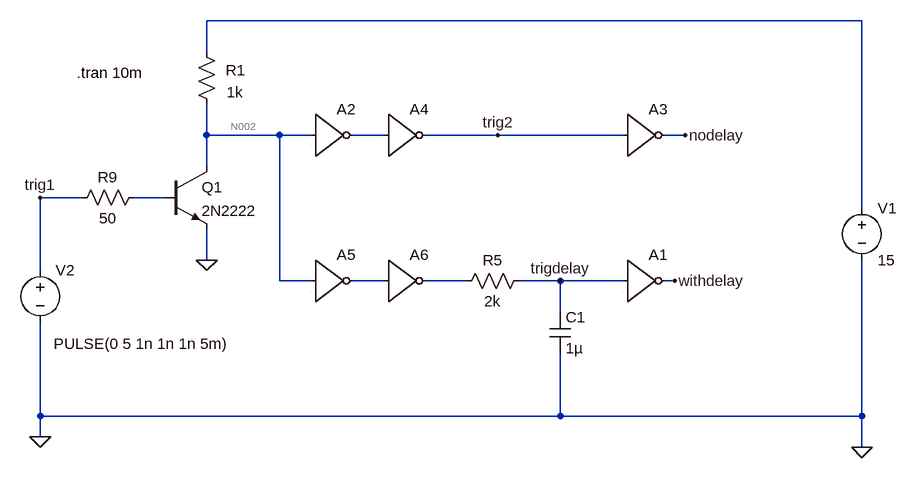
[diagram p0: schematic dc-contactor-delay-circuit.asc]
dc-contactor-delay-circuit.asc, the LTspice schematic file:
Version 4
SHEET 1 880 680
WIRE 432 -96 -576 -96
WIRE -576 -48 -576 -96
WIRE -576 80 -576 32
WIRE -464 80 -576 80
WIRE -416 80 -464 80
WIRE -304 80 -352 80
WIRE -128 80 -240 80
WIRE 64 80 -128 80
WIRE 160 80 128 80
WIRE -576 128 -576 80
WIRE -768 176 -832 176
WIRE -640 176 -688 176
WIRE 432 192 432 -96
WIRE -576 272 -576 224
WIRE -832 288 -832 176
WIRE -464 304 -464 80
WIRE -416 304 -464 304
WIRE -304 304 -352 304
WIRE -176 304 -240 304
WIRE -32 304 -96 304
WIRE 64 304 -32 304
WIRE 144 304 128 304
WIRE -32 352 -32 304
WIRE -832 512 -832 368
WIRE -32 512 -32 416
WIRE -32 512 -832 512
WIRE 432 512 432 272
WIRE 432 512 -32 512
WIRE -832 544 -832 512
WIRE 432 560 432 512
FLAG -832 544 0
FLAG -576 272 0
FLAG 432 560 0
FLAG 160 80 nodelay
FLAG 144 304 withdelay
FLAG -128 80 trig2
FLAG -832 176 trig1
FLAG -32 304 trigdelay
SYMBOL voltage 432 176 R0
WINDOW 123 0 0 Left 0
WINDOW 39 0 0 Left 0
SYMATTR InstName V1
SYMATTR Value 15
SYMBOL npn -640 128 R0
SYMATTR InstName Q1
SYMATTR Value 2N2222
SYMBOL res -80 288 R90
WINDOW 0 0 56 VBottom 2
WINDOW 3 32 56 VTop 2
SYMATTR InstName R5
SYMATTR Value 2k
SYMBOL cap -48 352 R0
SYMATTR InstName C1
SYMATTR Value 1µ
SYMBOL voltage -832 272 R0
WINDOW 3 291 129 Right 2
WINDOW 123 0 0 Left 0
WINDOW 39 0 0 Left 0
SYMATTR Value PULSE(0 5 1n 1n 1n 5m)
SYMATTR InstName V2
SYMBOL res -784 192 R270
WINDOW 0 32 56 VTop 2
WINDOW 3 0 56 VBottom 2
SYMATTR InstName R9
SYMATTR Value 50
SYMBOL res -592 -64 R0
WINDOW 0 45 44 Left 2
WINDOW 3 47 78 Left 2
SYMATTR InstName R1
SYMATTR Value 1k
SYMBOL Digital\\inv 64 16 R0
WINDOW 3 8 60 Invisible 2
SYMATTR Value Vhigh = 15,Vt = 7.4, Vh = 1.8
SYMATTR InstName A3
SYMBOL Digital\\inv 64 240 R0
WINDOW 3 8 60 Invisible 2
SYMATTR Value Vhigh = 15,Vt = 7.4, Vh = 1.8
SYMATTR InstName A1
SYMBOL Digital\\inv -416 16 R0
WINDOW 3 8 60 Invisible 2
SYMATTR Value Vhigh = 15,Vt = 7.4, Vh = 1.8
SYMATTR InstName A2
SYMBOL Digital\\inv -304 16 R0
WINDOW 3 8 60 Invisible 2
SYMATTR Value Vhigh = 15,Vt = 7.4, Vh = 1.8
SYMATTR InstName A4
SYMBOL Digital\\inv -416 240 R0
WINDOW 3 8 60 Invisible 2
SYMATTR Value Vhigh = 15,Vt = 7.4, Vh = 1.8
SYMATTR InstName A5
SYMBOL Digital\\inv -304 240 R0
WINDOW 3 8 60 Invisible 2
SYMATTR Value Vhigh = 15,Vt = 7.4, Vh = 1.8
SYMATTR InstName A6
TEXT -776 -16 Left 2 !.tran 10m

The netlist it stands for:
* dc-contactor-delay-circuit.asc
V1 N001 0 15
Q1 N002 N004 0 0 2N2222
R5 trigdelay N006 2k
C1 trigdelay 0 1µ
V2 trig1 0 PULSE(0 5 1n 1n 1n 5m)
R9 trig1 N004 50
R1 N001 N002 1k
A3 trig2 0 0 0 0 nodelay 0 0 BUF Vhigh = 15,Vt = 7.4, Vh = 1.8
A1 trigdelay 0 0 0 0 withdelay 0 0 BUF Vhigh = 15,Vt = 7.4, Vh = 1.8
A2 N002 0 0 0 0 N003 0 0 BUF Vhigh = 15,Vt = 7.4, Vh = 1.8
A4 N003 0 0 0 0 trig2 0 0 BUF Vhigh = 15,Vt = 7.4, Vh = 1.8
A5 N002 0 0 0 0 N005 0 0 BUF Vhigh = 15,Vt = 7.4, Vh = 1.8
A6 N005 0 0 0 0 N006 0 0 BUF Vhigh = 15,Vt = 7.4, Vh = 1.8
.model NPN NPN
.model PNP PNP
.lib standard.bjt
.tran 10m
.backanno
.end

* Results of the author's LTspice run, read from the files saved beside the schematic
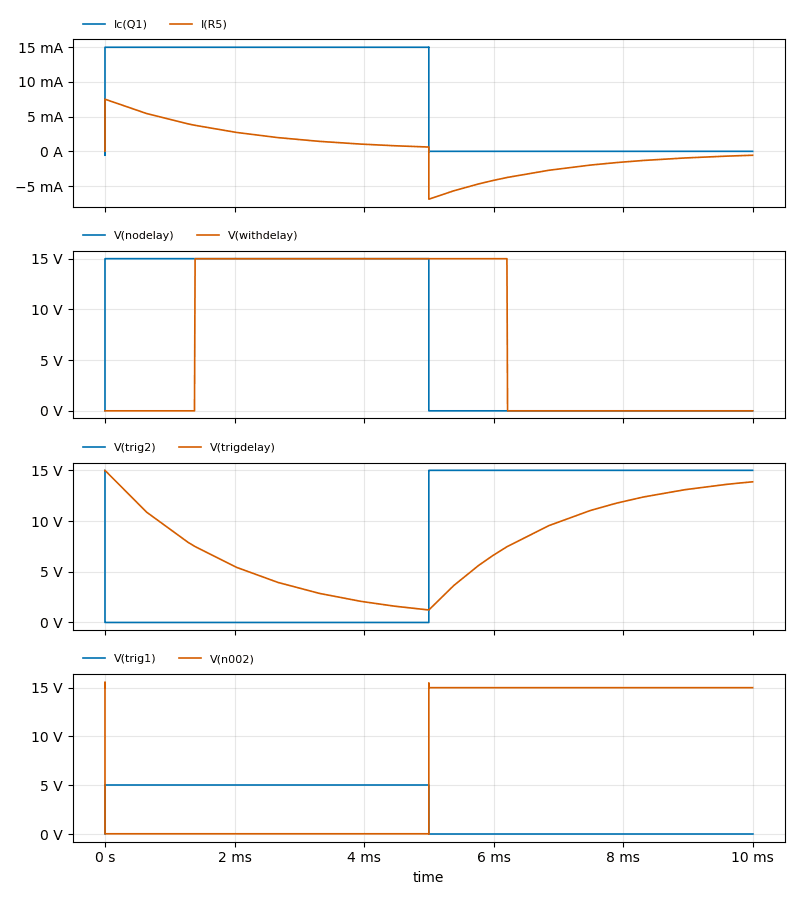
[diagram p1: Transient Analysis of dc-contactor-delay-circuit.asc, plotted from the saved traces]
* Transient Analysis, 1 run:
*   Ic(Q1): min -578.9 µA, max 14.99 mA, average 7.483 mA, rms 10.58 mA, last 0 A
*   I(R5): min -6.88 mA, max 7.496 mA, average 118.2 µA, rms 3.248 mA, last -565.6 µA
*   V(nodelay): min 0 V, max 15 V, average 7.501 V, rms 10.61 V, last 0 V
*   V(withdelay): min 0 V, max 15 V, average 7.237 V, rms 10.42 V, last 0 V
*   V(trig2): min 0 V, max 15 V, average 7.499 V, rms 10.61 V, last 15 V
*   V(trigdelay): min 1.232 V, max 15 V, average 7.736 V, rms 8.86 V, last 13.87 V
*   V(trig1): min 0 V, max 5 V, average 2.5 V, rms 3.536 V, last 0 V
*   V(n002): min 5.057 mV, max 15.58 V, average 7.517 V, rms 10.61 V, last 15 V